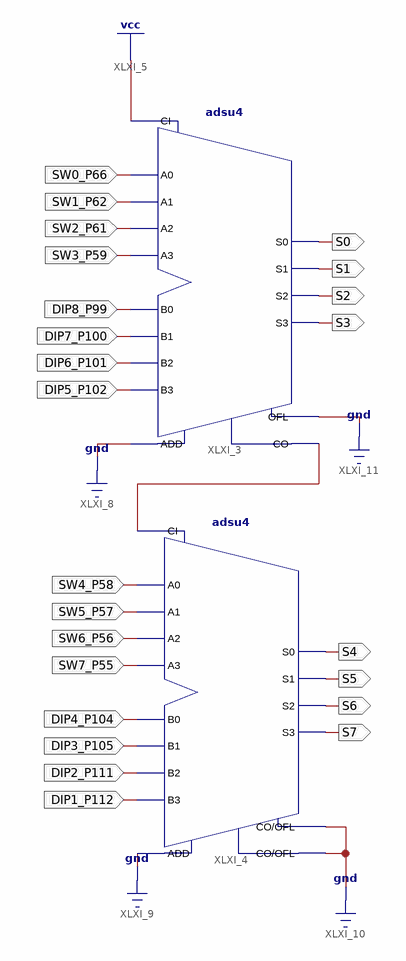
[diagram p0: schematic sheet 1]
// Xilinx ISE schematic SUB8bits.sch (spartan6) as structural Verilog: 2 symbols, 24 ports
module SUB8bits (
  input  DIP1_P112,
  input  DIP2_P111,
  input  DIP3_P105,
  input  DIP4_P104,
  input  SW7_P55,
  input  SW6_P56,
  input  SW5_P57,
  input  SW4_P58,
  input  DIP5_P102,
  input  DIP6_P101,
  input  DIP7_P100,
  input  DIP8_P99,
  input  SW3_P59,
  input  SW2_P61,
  input  SW1_P62,
  input  SW0_P66,
  output S0,
  output S1,
  output S2,
  output S3,
  output S4,
  output S5,
  output S6,
  output S7
);

  wire XLXN_19;

  adsu4 XLXI_3 (
    .A0(SW0_P66), .A1(SW1_P62), .A2(SW2_P61), .A3(SW3_P59), .ADD(1'b0), .B0(DIP8_P99), .B1(DIP7_P100),
    .B2(DIP6_P101), .B3(DIP5_P102), .CI(1'b1), .CO(XLXN_19), .OFL(1'b0), .S0(S0), .S1(S1), .S2(S2), .S3(S3));
  adsu4 XLXI_4 (
    .A0(SW4_P58), .A1(SW5_P57), .A2(SW6_P56), .A3(SW7_P55), .ADD(1'b0), .B0(DIP4_P104), .B1(DIP3_P105),
    .B2(DIP2_P111), .B3(DIP1_P112), .CI(XLXN_19), .CO(1'b0), .OFL(1'b0), .S0(S4), .S1(S5), .S2(S6), .S3(S7));
endmodule
